# Altium schematic sheet conf.SchDoc
size A
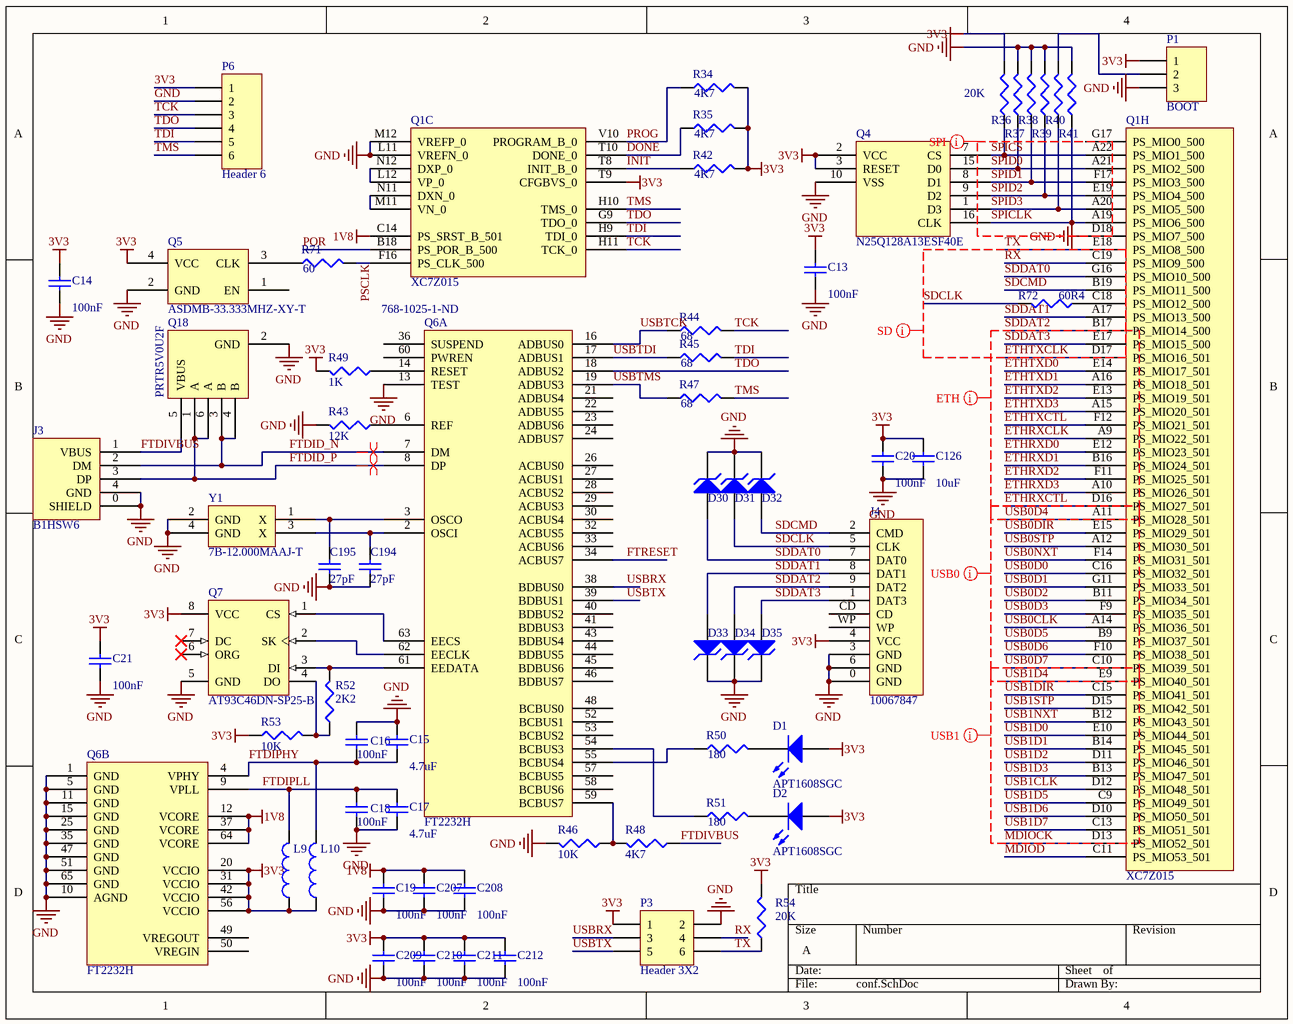
[diagram p0: conf.SchDoc]

## Parts
C13  value 100nF  [CAPC1005X06L]  (hidden comment: Cap)
C14  value 100nF  [CAPC1005X06L]  (hidden comment: Cap)
C15  value 4.7uF  [CAPC1608X90N]  (hidden comment: GRM188R60J475ME19D)
C16  value 100nF  [CAPC1005X06L]  (hidden comment: Cap)
C17  value 4.7uF  [CAPC1608X90N]  (hidden comment: GRM188R60J475ME19D)
C18  value 100nF  [CAPC1005X06L]  (hidden comment: Cap)
C19  value 100nF  [CAPC1005X06L]  (hidden comment: Cap)
C20  value 100nF  [CAPC1005X06L]  (hidden comment: Cap)
C21  value 100nF  [CAPC1005X06L]  (hidden comment: Cap)
C126  value 10uF  [CAPC1608X90N]  (hidden comment: GRM188R60G106ME47)
C194  value 27pF  [CAPC1608X90N]  (hidden comment: CL10C270JB8NNNC)
C195  value 27pF  [CAPC1608X90N]  (hidden comment: CL10C270JB8NNNC)
C207  value 100nF  [CAPC1005X06L]  (hidden comment: Cap)
C208  value 100nF  [CAPC1005X06L]  (hidden comment: Cap)
C209  value 100nF  [CAPC1005X06L]  (hidden comment: Cap)
C210  value 100nF  [CAPC1005X06L]  (hidden comment: Cap)
C211  value 100nF  [CAPC1005X06L]  (hidden comment: Cap)
C212  value 100nF  [CAPC1005X06L]  (hidden comment: Cap)
D1  APT1608SGC  [LED-0603]
D2  APT1608SGC  [LED-0603]
D30  EZAEG2A  [CAPC1005X55N]  (value not drawn)
D31  EZAEG2A  [CAPC1005X55N]  (value not drawn)
D32  EZAEG2A  [CAPC1005X55N]  (value not drawn)
D33  EZAEG2A  [CAPC1005X55N]  (value not drawn)
D34  EZAEG2A  [CAPC1005X55N]  (value not drawn)
D35  EZAEG2A  [CAPC1005X55N]  (value not drawn)
J3  B1HSW6  [USB-B1HSW6]
J4  10067847  [SD-10067847]
L9  BLM18SG121TN1  [CAPC1608X90N]  (value not drawn)
L10  BLM18SG121TN1  [CAPC1608X90N]  (value not drawn)
P1  BOOT  [HDR1X3]
P3  Header 3X2  [HDR2X3]
P6  Header 6  [HDR1X6]
Q1  XC7Z015  [BGA484x22]  (parts C,H of 9)
Q4  N25Q128A13ESF40E  [SOP127P1030X265-16N]
Q5  ASDMB-33.333MHZ-XY-T  [ASDMB]
Q6  FT2232H  Supplier Part Number 1: 768-1025-1-ND  [FT2232H]  (parts A,B of 2)
Q7  AT93C46DN-SP25-B  [8S1_N]
Q18  PRTR5V0U2F  [SOT886]
R34  value 4K7  [J1-0603]  (hidden comment: RC1608J472CS)
R35  value 4K7  [J1-0603]  (hidden comment: RC1608J472CS)
R36  value 20K  [J1-0603]  (hidden comment: RC1608F203CS)
R37  RC1608F203CS  [J1-0603]  (value not drawn)
R38  RC1608F203CS  [J1-0603]  (value not drawn)
R39  RC1608F203CS  [J1-0603]  (value not drawn)
R40  RC1608F203CS  [J1-0603]  (value not drawn)
R41  RC1608F203CS  [J1-0603]  (value not drawn)
R42  value 4K7  [J1-0603]  (hidden comment: RC1608J472CS)
R43  value 12K  [J1-0603]  (hidden comment: RC1608F123CS)
R44  value 68  [J1-0603]  (hidden comment: RC1608J680CS)
R45  value 68  [J1-0603]  (hidden comment: RC1608J680CS)
R46  value 10K  [J1-0603]  (hidden comment: RC1608F103CS)
R47  value 68  [J1-0603]  (hidden comment: RC1608J680CS)
R48  value 4K7  [J1-0603]  (hidden comment: RC1608J472CS)
R49  value 1K  [J1-0603]  (hidden comment: RC1608J102CS)
R50  value 180  [J1-0603]  (hidden comment: RC1608J181CS)
R51  value 180  [J1-0603]  (hidden comment: RC1608J181CS)
R52  value 2K2  [J1-0603]  (hidden comment: RC1608J222CS)
R53  value 10K  [J1-0603]  (hidden comment: RC1608F103CS)
R54  value 20K  [J1-0603]  (hidden comment: RC1608F203CS)
R71  value 60  [J1-0603]  (hidden comment: RC1608F60R4CS)
R72  value 60R4  [CAPC1005X06L]  (hidden comment: RC1005F60R4CS)
Y1  7B-12.000MAAJ-T  [XTAL]

## Nets
1V8: C19.1 C207.1 C208.1 Q1.C14(PS_SRST_B_501) Q6.12(VCORE) Q6.37(VCORE) Q6.64(VCORE)
3V3: C13.2 C14.2 C20.2 C21.1 C126.2 C209.1 C210.1 C211.1 C212.1 D1.A D2.A J4.4(VCC) L9.1 L10.1 P1.1 P3.1 P6.1 Q1.T9(CFGBVS_0) Q4.2(VCC) Q4.3(RESET) Q5.4(VCC) Q6.20(VCCIO) Q6.31(VCCIO) Q6.42(VCCIO) Q6.56(VCCIO) Q7.8(VCC) R34.2 R35.2 R36.2 R42.2 R49.2 R53.1 R54.2
GND: C13.1 C14.1 C15.2 C16.2 C17.1 C18.1 C19.2 C20.1 C21.2 C126.1 C194.2 C195.1 C207.2 C208.2 C209.2 C210.2 C211.2 C212.2 D30.2(K) D31.2(K) D32.2(K) D33.2(K) D34.2(K) D35.2(K) J3.0(SHIELD) J3.4(GND) J4.0(GND) J4.3(GND) J4.6(GND) P1.3 P3.2 P6.2 Q1.D18(PS_MIO7_500) Q1.L11(VREFN_0) Q1.M12(VREFP_0) Q4.10(VSS) Q5.2(GND) Q6.1(GND) Q6.5(GND) Q6.10(AGND) Q6.11(GND) Q6.13(TEST) Q6.15(GND) Q6.25(GND) Q6.35(GND) Q6.47(GND) Q6.51(GND) Q6.65(GND) Q7.5(GND) Q18.2(GND) R37.2 R38.2 R39.2 R41.2 R43.2 R46.2 Y1.2(GND) Y1.4(GND)
DONE: Q1.T10(DONE_0) R35.1
ETHRXCLK: Q1.A9(PS_MIO22_501)
ETHRXCTL: Q1.D16(PS_MIO27_501)
ETHRXD0: Q1.E12(PS_MIO23_501)
ETHRXD1: Q1.B16(PS_MIO24_501)
ETHRXD2: Q1.F11(PS_MIO25_501)
ETHRXD3: Q1.A10(PS_MIO26_501)
ETHTXCLK: Q1.D17(PS_MIO16_501)
ETHTXCTL: Q1.F12(PS_MIO21_501)
ETHTXD0: Q1.E14(PS_MIO17_501)
ETHTXD1: Q1.A16(PS_MIO18_501)
ETHTXD2: Q1.E13(PS_MIO19_501)
ETHTXD3: Q1.A15(PS_MIO20_501)
FTDID_N: J3.2(DM) Q6.7(DM) Q18.3(B) Q18.4(B)
FTDID_P: J3.3(DP) Q6.8(DP) Q18.1(A) Q18.6(A)
FTDIPHY: C15.1 C16.1 L10.2 Q6.4(VPHY)
FTDIPLL: C17.2 C18.2 L9.2 Q6.9(VPLL)
FTDIVBUS: J3.1(VBUS) Q18.5(VBUS) R48.1
FTRESET: Q6.34(ACBUS7)
INIT: Q1.T8(INIT_B_0) R42.1
MDIOCK: Q1.D13(PS_MIO52_501)
MDIOD: Q1.C11(PS_MIO53_501)
POR: Q1.B18(PS_POR_B_500)
PROG: Q1.V10(PROGRAM_B_0) R34.1
PSCLK: Q1.F16(PS_CLK_500) R71.2
RX: P3.4 Q1.C19(PS_MIO9_500)
SDCLK: D31.1(A) J4.5(CLK) R72.2
SDCMD: D32.1(A) J4.2(CMD) Q1.B19(PS_MIO11_500)
SDDAT0: D30.1(A) J4.7(DAT0) Q1.G16(PS_MIO10_500)
SDDAT1: D33.1(A) J4.8(DAT1) Q1.A17(PS_MIO13_500)
SDDAT2: D34.1(A) J4.9(DAT2) Q1.B17(PS_MIO14_500)
SDDAT3: D35.1(A) J4.1(DAT3) Q1.E17(PS_MIO15_500)
SPICLK: Q1.A19(PS_MIO6_500) Q4.16(CLK) R41.1
SPICS: Q1.A22(PS_MIO1_500) Q4.7(CS) R36.1
SPID0: Q1.A21(PS_MIO2_500) Q4.15(D0) R37.1
SPID1: Q1.F17(PS_MIO3_500) Q4.8(D1) R38.1
SPID2: Q1.E19(PS_MIO4_500) Q4.9(D2) R39.1
SPID3: Q1.A20(PS_MIO5_500) Q4.1(D3) R40.1
TCK: P6.3 Q1.H11(TCK_0) R44.2
TDI: P6.5 Q1.H9(TDI_0) R45.2
TDO: P6.4 Q1.G9(TDO_0) Q6.18(ADBUS2)
TMS: P6.6 Q1.H10(TMS_0) R47.2
TX: P3.6 Q1.E18(PS_MIO8_500) R54.1
USB0CLK: Q1.A14(PS_MIO36_501)
USB0D0: Q1.C16(PS_MIO32_501)
USB0D1: Q1.G11(PS_MIO33_501)
USB0D2: Q1.B11(PS_MIO34_501)
USB0D3: Q1.F9(PS_MIO35_501)
USB0D4: Q1.A11(PS_MIO28_501)
USB0D5: Q1.B9(PS_MIO37_501)
USB0D6: Q1.F10(PS_MIO38_501)
USB0D7: Q1.C10(PS_MIO39_501)
USB0DIR: Q1.E15(PS_MIO29_501)
USB0NXT: Q1.F14(PS_MIO31_501)
USB0STP: Q1.A12(PS_MIO30_501)
USB1CLK: Q1.D12(PS_MIO48_501)
USB1D0: Q1.E10(PS_MIO44_501)
USB1D1: Q1.B14(PS_MIO45_501)
USB1D2: Q1.D11(PS_MIO46_501)
USB1D3: Q1.B13(PS_MIO47_501)
USB1D4: Q1.E9(PS_MIO40_501)
USB1D5: Q1.C9(PS_MIO49_501)
USB1D6: Q1.D10(PS_MIO50_501)
USB1D7: Q1.C13(PS_MIO51_501)
USB1DIR: Q1.C15(PS_MIO41_501)
USB1NXT: Q1.B12(PS_MIO43_501)
USB1STP: Q1.D15(PS_MIO42_501)
USBRX: P3.3 Q6.38(BDBUS0)
USBTCK: Q6.16(ADBUS0) R44.1
USBTDI: Q6.17(ADBUS1) R45.1
USBTMS: Q6.19(ADBUS3) R47.1
USBTX: P3.5 Q6.39(BDBUS1)
NetC194_1: C194.1 Q6.2(OSCI) Y1.3(X)
NetC195_2: C195.2 Q6.3(OSCO) Y1.1(X)
NetD1_K: D1.K R50.2
NetD2_K: D2.K R51.2
NetP1_2: P1.2 R40.2
NetQ1_C18: Q1.C18(PS_MIO12_500) R72.1
NetQ1_L12: Q1.L12(VP_0) Q1.N12(DXP_0)
NetQ1_M11: Q1.M11(VN_0) Q1.N11(DXN_0)
NetQ5_3: Q5.3(CLK) R71.1
NetQ6_6: Q6.6(REF) R43.1
NetQ6_14: Q6.14(RESET) R49.1
NetQ6_54: Q6.54(BCBUS3) R51.1
NetQ6_55: Q6.55(BCBUS4) R50.1
NetQ6_59: Q6.59(BCBUS7) R46.1 R48.2
NetQ6_61: Q6.61(EEDATA) Q7.3(DI) R52.2
NetQ6_62: Q6.62(EECLK) Q7.2(SK)
NetQ6_63: Q6.63(EECS) Q7.1(CS)
NetQ7_4: Q7.4(DO) R52.1 R53.2

Not connected (* = marked no-connect by the designer): J4 CD WP; Q1 G17(PS_MIO0_500); Q5 1(EN); Q6 21(ADBUS4) 22(ADBUS5) 23(ADBUS6) 24(ADBUS7) 26(ACBUS0) 27(ACBUS1) 28(ACBUS2) 29(ACBUS3) 30(ACBUS4) 32(ACBUS5) 33(ACBUS6) 36(SUSPEND) 40(BDBUS2) 41(BDBUS3) 43(BDBUS4) 44(BDBUS5) 45(BDBUS6) 46(BDBUS7) 48(BCBUS0) 49(VREGOUT) 50(VREGIN) 52(BCBUS1) 53(BCBUS2) 57(BCBUS5) 58(BCBUS6) 60(PWREN); Q7 6(ORG)* 7(DC)*

## Layout directives
net class SD: ETHTXCLK, RX, SDCLK, SDCMD, SDDAT0, SDDAT1, SDDAT2, SDDAT3, TX
net class ETH: ETHRXCLK, ETHRXCTL, ETHRXD0, ETHRXD1, ETHRXD2, ETHRXD3, ETHTXCLK, ETHTXCTL, ETHTXD0, ETHTXD1, ETHTXD2, ETHTXD3, SDDAT2, SDDAT3, USB0D4
net class USB0: ETHRXCTL, USB0CLK, USB0D0, USB0D1, USB0D2, USB0D3, USB0D4, USB0D5, USB0D6, USB0D7, USB0DIR, USB0NXT, USB0STP, USB1D4
net class USB1: MDIOCK, USB0D7, USB1CLK, USB1D0, USB1D1, USB1D2, USB1D3, USB1D4, USB1D5, USB1D6, USB1D7, USB1DIR, USB1NXT, USB1STP
net class SPI: GND, SPICLK, SPICS, SPID0, SPID1, SPID2, SPID3
differential pair: FTDID_N, FTDID_P

## Library data of the parts
C13-C21 C126 C194 C195 C207-C212 = Cap: Capacitor; Published: 8-Jun-2000; LatestRevisionDate: 17-Jul-2002; LatestRevisionNote: Re-released for DXP Platform.; PackageReference: RAD-0.3; Publisher: Altium Limited; PackageDescription: Radial Cap, Thru-Hole; 2 Leads; 0.3 in Pin Spacing; Supplier 1: Digi-Key
  C13 C14 C16 C18-C21 C207-C212: Supplier Part Number 1: 1276-1443-1-ND
  C15 C17: Supplier Part Number 1: 490-5421-1-ND
  C126: Supplier Part Number 1: 490-3298-1-ND
  C194 C195: Supplier Part Number 1: 1276-1086-1-ND
D1 D2 = LED2: Typical RED, GREEN, YELLOW, AMBER GaAs LED; Published: 8-Jun-2000; LatestRevisionDate: 17-Jul-2002; LatestRevisionNote: Re-released for DXP Platform.; PackageVersion: Feb-2002; PackageReference: 3.2X1.6X1.1; Publisher: Altium Limited; PackageDescription: SM LED; 2 Flat Leads; Supplier 1: Digi-Key; Supplier Part Number 1: 754-1121-1-ND
D30-D35 = D Zener: Zener Diode; Published: 8-Jun-2000; LatestRevisionDate: 17-Jul-2002; LatestRevisionNote: Re-released for DXP Platform.; PackageReference: DIODE-0.7; Publisher: Altium Limited; PackageDescription: Diode, Thru-Hole; 2 Leads; 0.7 in Pin Spacing; Supplier 1: Digi-Key; Supplier Part Number 1: P13571CT-ND
J3 = USB: Supplier 1: Digi-Key; Supplier Part Number 1: ED2982-ND
J4 = SDCARD: Supplier 1: Digi-Key; Supplier Part Number 1: 609-3956-1-ND
L9 L10 = Inductor: Code_IEC: 1005; Value: 10mH; Published: 8-Jun-2000; LatestRevisionDate: 29-May-2009; LatestRevisionNote: IPC-7351 Footprint Added.; PackageReference: 0402-A; Publisher: Altium Limited; PackageDescription: Chip Inductor; Code_JEITA: 0402; Supplier 1: Digi-Key; Supplier Part Number 1: 490-3996-1-ND
P1 = Header 3: Header, 3-Pin; LatestRevisionDate: 17-Jul-2002; LatestRevisionNote: Re-released for DXP Platform.; Publisher: Altium Limited
P3 = Header 3X2: Header, 3-Pin, Dual row; LatestRevisionDate: 17-Jul-2002; LatestRevisionNote: Re-released for DXP Platform.; Publisher: Altium Limited
P6 = Header 6: Header, 6-Pin; LatestRevisionDate: 17-Jul-2002; LatestRevisionNote: Re-released for DXP Platform.; Publisher: Altium Limited
Q4 = QUADSPI: Supplier 1: Digi-Key; Supplier Part Number 1: 557-1563-ND
Q5 = osc: Supplier 1: Digi-Key; Supplier Part Number 1: 535-11143-1-ND
Q7 = AT93C46DN-SP25-B: 1Kbit (128 x 8 or 64 x 16), 3-wire Bus Serial Automotive EEPROM, 2.5V, 8-Pin SOIC, Bulk; Published: 20-Sep-2010; DatasheetVersion: 8674B,  Oct-2009; PackageVersion: revC, Mar-2005; PackageReference: 8S1; Publisher: Altium Limited; PackageDescription: 8-Lead (0.150" Wide Body), Plastic Gull Wing Small Outline (JEDEC SOIC); Code_JEDEC: MS-012-AA; Code_IPC: SOIC127P600-8; ComponentLink1Description: Manufacturer Link; ComponentLink1URL: http://www.atmel.com/products/serial/default.asp; ComponentLink2Description: Datasheet; ComponentLink2URL: http://www.atmel.com/dyn/resources/prod_documents/doc8674.pdf; ComponentLink3Description: Atmel.com Home; ComponentLink3URL: http://www.atmel.com; Supplier 1: Digi-Key; Supplier Part Number 1: AT93C46DN-SH-B-ND
R34-R36 R42-R54 R71 R72 = Res3: Resistor; Published: 8-Jun-2000; LatestRevisionDate: 29-May-2009; LatestRevisionNote: IPC-7351 Footprint Added.; PackageReference: J1-0603; PackageDescription: Chip Resistor; Supplier 1: Digi-Key
  R34 R35 R42: Publisher: Altium Limited; Supplier Part Number 1: 1276-5078-1-ND
  R36 R54: Publisher: Altium Limited; Supplier Part Number 1: 1276-4768-1-ND
  R43: Supplier Part Number 1: 1276-4750-1-ND
  R44 R45 R47: Publisher: Altium Limited; Supplier Part Number 1: 1276-5034-1-ND
  R46 R53: Publisher: Altium Limited; Supplier Part Number 1: 1276-3485-1-ND
  R48: Supplier Part Number 1: 1276-5078-1-ND
  R49: Supplier Part Number 1: 1276-5062-1-ND
  R50 R51: Publisher: Altium Limited; Supplier Part Number 1: 1276-5044-1-ND
  R52: Publisher: Altium Limited; Supplier Part Number 1: 1276-5070-1-ND
  R71: Supplier Part Number 1: 1276-4547-1-ND
  R72: Publisher: Altium Limited; Supplier Part Number 1: 1276-3929-1-ND
R37-R41 = Res3: Resistor; Value: 20K; Published: 8-Jun-2000; LatestRevisionDate: 29-May-2009; LatestRevisionNote: IPC-7351 Footprint Added.; PackageReference: J1-0603; Publisher: Altium Limited; PackageDescription: Chip Resistor; Supplier 1: Digi-Key; Supplier Part Number 1: 1276-4768-1-ND
Y1 = XTAL: Supplier 1: Digi-Key; Supplier Part Number 1: 887-1099-1-ND
Q1 = XC7Z015: Supplier 1: Digi-Key; Supplier Part Number 1: 122-1905-ND
Q6 = FT2232H: Supplier 1: Digi-Key
Q18 = PRTR5V0U2F: Supplier 1: Digi-Key; Supplier Part Number 1: 568-4677-1-ND